# Altium schematic sheet H-00488 - Card Slot Master.SchDoc: Card Slot Master
size 403 x 281 mm; DocumentNumber: 9; SheetNumber: 9; SheetTotal: 12
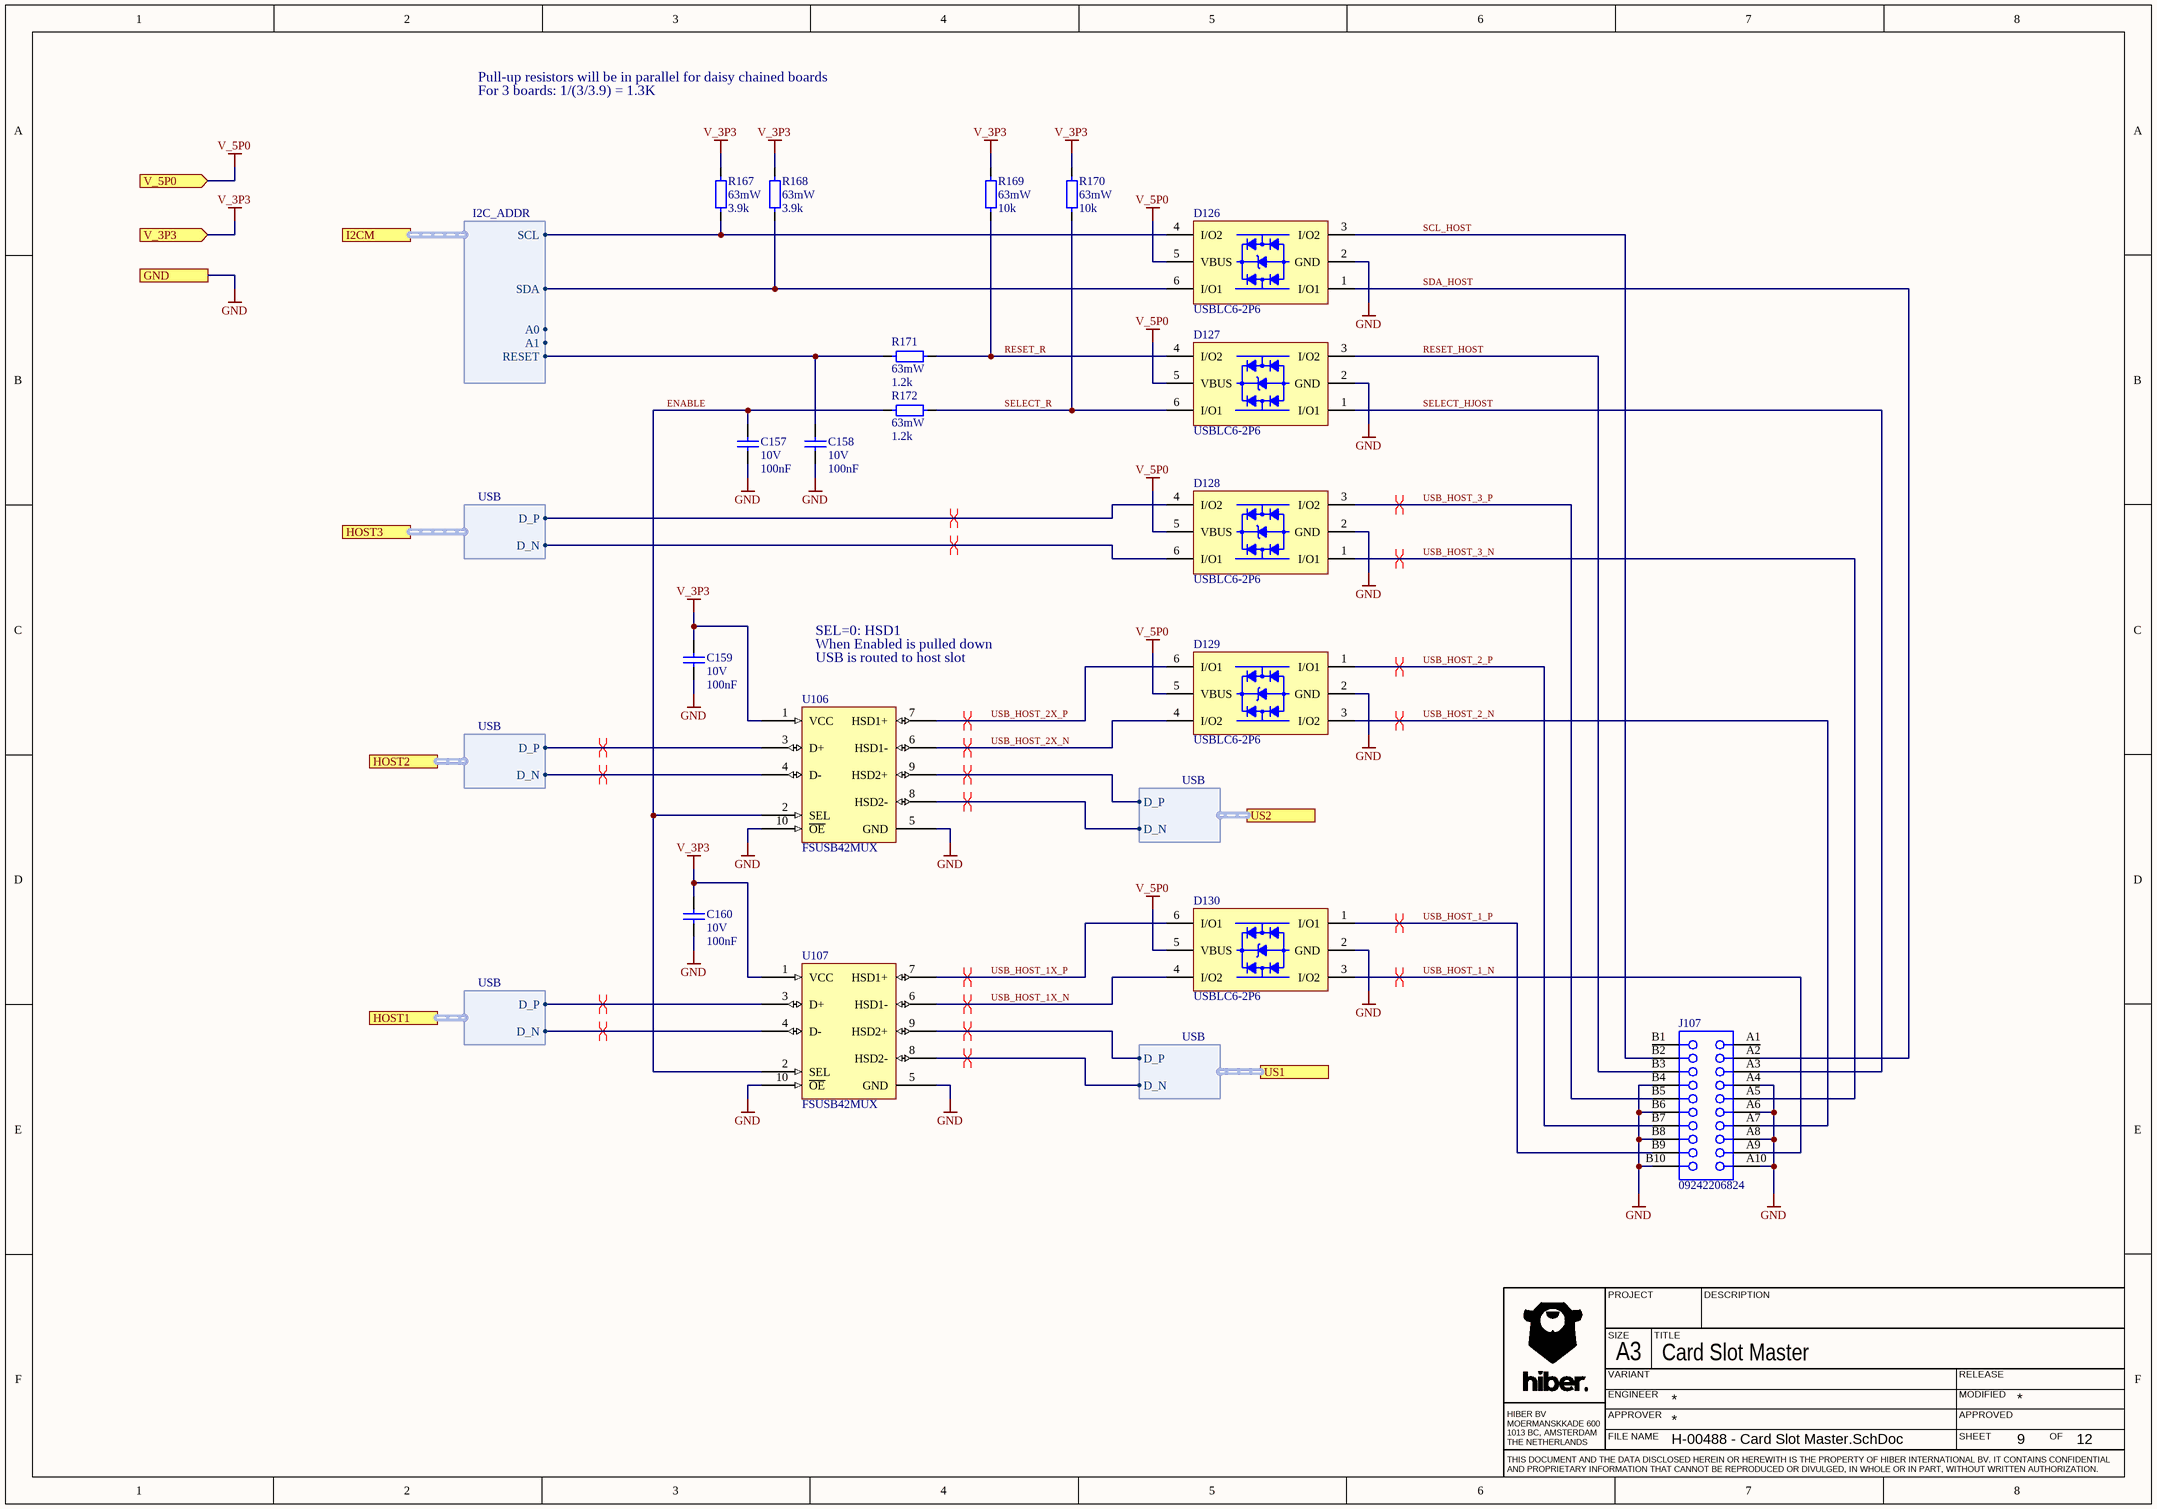
[diagram p0: H-00488 - Card Slot Master.SchDoc]

## Parts
C157  value 100nF  Rated Voltage: 10V  [CAPC100X50X55L30N]  (hidden comment: C0402C104K8RACTU)
C158  value 100nF  Rated Voltage: 10V  [CAPC100X50X55L30N]  (hidden comment: C0402C104K8RACTU)
C159  value 100nF  Rated Voltage: 10V  [CAPC100X50X55L30N]  (hidden comment: C0402C104K8RACTU)
C160  value 100nF  Rated Voltage: 10V  [CAPC100X50X55L30N]  (hidden comment: C0402C104K8RACTU)
D126  USBLC6-2P6  [DIOSOFL6P50_160X160X95L29X26]
D127  USBLC6-2P6  [DIOSOFL6P50_160X160X95L29X26]
D128  USBLC6-2P6  [DIOSOFL6P50_160X160X95L29X26]
D129  USBLC6-2P6  [DIOSOFL6P50_160X160X95L29X26]
D130  USBLC6-2P6  [DIOSOFL6P50_160X160X95L29X26]
J107  09242206824  [HARTING_09242206824]
R167  value 3.9k  Rated Power: 63mW  [RESC100X50X40L25N]  (hidden comment: CRCW04023K90FKED)
R168  value 3.9k  Rated Power: 63mW  [RESC100X50X40L25N]  (hidden comment: CRCW04023K90FKED)
R169  value 10k  Rated Power: 63mW  [RESC100X50X40L25N]  (hidden comment: CRCW040210K0FKED)
R170  value 10k  Rated Power: 63mW  [RESC100X50X40L25N]  (hidden comment: CRCW040210K0FKED)
R171  value 1.2k  Rated Power: 63mW  [RESC100X50X40L25N]  (hidden comment: CRCW04021K20FKED)
R172  value 1.2k  Rated Power: 63mW  [RESC100X50X40L25N]  (hidden comment: CRCW04021K20FKED)
U106  FSUSB42MUX  [SOP10P50_300X490X110L55X25]
U107  FSUSB42MUX  [SOP10P50_300X490X110L55X25]

## Ports
GND, HOST1 (harness USB), HOST2 (harness USB), HOST3 (harness USB), I2CM (harness I2C_ADDR), US1 (harness USB), US2 (harness USB), V_3P3 (in), V_5P0 (in)

## Harnesses
USB: D_P, D_N
I2C_ADDR: SDA, SCL, A0, A1, RESET

## Nets
GND: C157.2 C158.2 C159.2 C160.2 D126.2(GND) D127.2(GND) D128.2(GND) D129.2(GND) D130.2(GND) J107.A4 J107.A6 J107.A8 J107.A10 J107.B4 J107.B6 J107.B8 J107.B10 U106.5(GND) U106.10(~{OE}) U107.5(GND) U107.10(~{OE}) ; port GND
V_3P3: C159.1 C160.1 R167.2 R168.2 R169.2 R170.2 U106.1(VCC) U107.1(VCC) ; port V_3P3
V_5P0: D126.5(VBUS) D127.5(VBUS) D128.5(VBUS) D129.5(VBUS) D130.5(VBUS) ; port V_5P0
ENABLE: C157.1 R172.2 U106.2(SEL) U107.2(SEL)
RESET_HOST: D127.3(I/O2) J107.B3
RESET_R: D127.4(I/O2) R169.1 R171.1
SCL_HOST: D126.3(I/O2) J107.B2
SDA_HOST: D126.1(I/O1) J107.A2
SELECT_HJOST: D127.1(I/O1) J107.A3
SELECT_R: D127.6(I/O1) R170.1 R172.1
USB_HOST_1_N: D130.3(I/O2) J107.A9
USB_HOST_1_P: D130.1(I/O1) J107.B9
USB_HOST_1X_N: D130.4(I/O2) U107.6(HSD1-)
USB_HOST_1X_P: D130.6(I/O1) U107.7(HSD1+)
USB_HOST_2_N: D129.3(I/O2) J107.A7
USB_HOST_2_P: D129.1(I/O1) J107.B7
USB_HOST_2X_N: D129.4(I/O2) U106.6(HSD1-)
USB_HOST_2X_P: D129.6(I/O1) U106.7(HSD1+)
USB_HOST_3_N: D128.1(I/O1) J107.A5
USB_HOST_3_P: D128.3(I/O2) J107.B5
NetC158_1: C158.1 R171.2 ; port I2CM.RESET
NetD126_4: D126.4(I/O2) R167.1 ; port I2CM.SCL
NetD126_6: D126.6(I/O1) R168.1 ; port I2CM.SDA
NetD128_4: D128.4(I/O2) ; port HOST3.D_P
NetD128_6: D128.6(I/O1) ; port HOST3.D_N
NetU106_3: U106.3(D+) ; port HOST2.D_P
NetU106_4: U106.4(D-) ; port HOST2.D_N
NetU106_8: U106.8(HSD2-) ; port US2.D_N
NetU106_9: U106.9(HSD2+) ; port US2.D_P
NetU107_3: U107.3(D+) ; port HOST1.D_P
NetU107_4: U107.4(D-) ; port HOST1.D_N
NetU107_8: U107.8(HSD2-) ; port US1.D_N
NetU107_9: U107.9(HSD2+) ; port US1.D_P

Not connected (* = marked no-connect by the designer): J107 A1 B1

## Layout directives
differential pair: NetD128_4, NetD128_6, NetU106_3, NetU106_4, NetU106_8, NetU106_9, NetU107_3, NetU107_4, NetU107_8, NetU107_9, USB_HOST_1_N, USB_HOST_1_P, USB_HOST_1X_N, USB_HOST_1X_P, USB_HOST_2_N, USB_HOST_2_P, USB_HOST_2X_N, USB_HOST_2X_P, USB_HOST_3_N, USB_HOST_3_P

## Notes on the sheet
- Pull-up resistors will be in parallel for daisy chained boards
- For 3 boards: 1/(3/3.9) = 1.3K
- SEL=0: HSD1
- When Enabled is pulled down
- USB is routed to host slot
- PROJECT
- DESCRIPTION
- SIZE
- ENGINEER
- VARIANT
- A3
- TITLE
- MODIFIED
- RELEASE
- HIBER BV
  MOERMANSKKADE 600
  1013 BC, AMSTERDAM
  THE NETHERLANDS
- FILE NAME
- APPROVER
- SHEET
- APPROVED
- OF
- THIS DOCUMENT AND THE DATA DISCLOSED HEREIN OR HEREWITH IS THE PROPERTY OF HIBER INTERNATIONAL BV. IT CONTAINS CONFIDENTIAL AND PROPRIETARY INFORMATION THAT CANNOT BE REPRODUCED OR DIVULGED, IN WHOLE OR IN PART, WITHOUT WRITTEN AUTHORIZATION.

## Library data of the parts
C157-C160 = CMP-00367-3: CAP Standard 0402 (1005) 100,0nF 10V X7R (Standard); Type: Ceramic; Tolerance: 10%; Termination Finish: 100% Matte Sn; Qualification: Standard; RoHS: Yes; Mount: SMT; Case/Package: 0402 (1005); Failure Rate: N/A; Pins: 2; Dielectric: X7R
D126-D130 = CMP-00780-2: TVS DIODE 5.25VWM 17VC SOT666; Reverse Breakdown Voltage: 6V; ESD Protection: Yes; Max Reverse Leakage Current: 150nA; Number of Elements: 1; Clamping Voltage: 17V; Direction: Bidirectional, Unidirectional; Capacitance: 3.5pF; Working Voltage: 5V; Number of Channels: 2; Test Current: 1mA; Peak Pulse Current: 5A; Element Configuration: Dual; Qualification: Standard; Max Operating Temperature: 125°C; Lead Free: Lead Free; Contact Plating: Matte, Tin; Package Quantity: 1; Case/Package: SOT-666; Min Operating Temperature: -40°C; Length: 1.7mm; Breakdown Voltage: 6V; Packaging: Tape and Reel; REACH SVHC: No SVHC; Termination: SMD/SMT; Mount: Surface Mount; Power Line Protection: Yes; Radiation Hardening: No; RoHS: Yes; Leakage Current: 150nA; Polarity: Bidirectional, Unidirectional; Depth: 1.3mm; Number of Bidirectional Channels: 2; Number of Pins: 6; Height: 0.6mm; Reverse Standoff Voltage: 5V; Width: 1.3mm; Min Breakdown Voltage: 6V; Operating Supply Voltage: 5V; Max Breakdown Voltage: 6V
J107 = CMP-01077-1: Board Euro Connector; RoHS: Yes; Mount: TH; Connector Type: BOARD EURO CONNECTOR
R167 R168 = CMP-00284-8: RES Standard Thick Film 0402 3K90 ±1% 0,063W; Qualification: Automotive; Rated Voltage: 50V; Mount: Surface Mount; Termination Finish: Pure tin solder contacts on Ni barrier layer; Tolerance: 1%; Type: Standard Thick Film; Case/Package: 0402 (1005); Failure Rate: N/A; Pins: 2; RoHS: Yes
R169 R170 = CMP-00294-7: RES Standard Thick Film 0402 10K0 ±1% 0,063W; Qualification: Automotive; Rated Voltage: 50V; Mount: Surface Mount; Termination Finish: Pure tin solder contacts on Ni barrier layer; Tolerance: 1%; Type: Standard Thick Film; Case/Package: 0402 (1005); Failure Rate: N/A; Pins: 2; RoHS: Yes
R171 R172 = CMP-00272-8: RES Standard Thick Film 0402 1K20 ±1% 0,063W; Qualification: Automotive; Rated Voltage: 50V; Mount: Surface Mount; Termination Finish: Pure tin solder contacts on Ni barrier layer; Tolerance: 1%; Type: Standard Thick Film; Case/Package: 0402 (1005); Failure Rate: N/A; Pins: 2; RoHS: Yes
U106 U107 = CMP-00416-7: IC USB SWITCH DPDT 10MSOP; Min Supply Voltage: 3V; Supply Type: Single; Current: 100mA; Operating Supply Voltage: 4.3V; Data Rate: 480Mbps; Number of Outputs: 4; Number of Channels: 2; On-State Resistance: 6.5R; Length: 3mm; REACH SVHC: No SVHC; Radiation Hardening: No; Throw Configuration: DPDT; Width: 3mm; Mount: Surface Mount; Weight: 0.1125g; Min Operating Temperature: -40°C; Packaging: Tape and Reel; Max Supply Voltage: 4.3V; Voltage: 4.3V; Number of Pins: 10; Package Quantity: 1; Max Operating Temperature: 85°C; Height: 0.85mm; Lead Free: Lead Free; Number of Inputs: 2; Case/Package: MSOP